# EAGLE schematic AD620_AC (EAGLE 9.6.2)
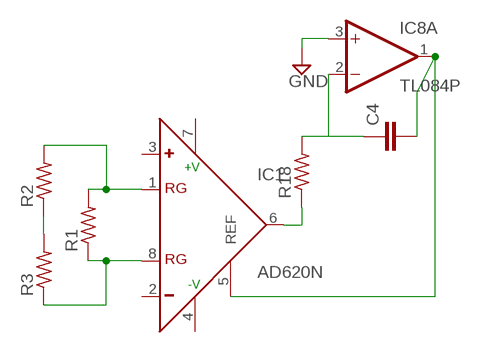
[diagram p0: schematic, sheet 1]

## Parts
C4  C-EU050-030X075  [C050-030X075]
IC1  AD620N  [DIL08]
IC8  TL084P  [DIL14]
R1  R-US_0204/5  [0204/5]
R2  R-US_0204/5  [0204/5]
R3  R-US_0204/5  [0204/5]
R18  R-US_0204/5  [0204/5]

## Nets
GND: IC8.3(A:+IN)
N$1: IC1.1(RG) R1.2 R2.2
N$2: IC1.8(RG) R1.1 R3.1
N$3: R2.1 R3.2
N$5: IC1.6(OUT) R18.1
N$11: C4.1 IC8.2(A:-IN) R18.2
N$20: C4.2 IC1.5(REF) IC8.1(A:OUT)
Unconnected: IC1.2(-) IC1.3(+) IC8.5(B:+IN) IC8.6(B:-IN) IC8.7(B:OUT) IC8.8(C:OUT) IC8.9(C:-IN) IC8.10(C:+IN) IC8.12(D:+IN) IC8.13(D:-IN) IC8.14(D:OUT)

## Power pins joined to a net without a drawn wire
+V: IC1.7(+V)
-V: IC1.4(-V)
V+: IC8.4(P:V+)
V-: IC8.11(P:V-)

## Library data of the parts
C4 = rcl:C-EU: CAPACITOR, European symbol; SPICEPREFIX: C
IC1 = analog-devices:AD620: Low Cost, Low Power, Instrumentation Amplifier Source: http://www.analog.com/UploadedFiles/Data_Sheets/37793330023930AD620_e.pdf; MF: ALTERA CORPORATION; MPN: AD620AN; OC_FARNELL: 1523782; OC_NEWARK: 05F7108
IC8 = linear:TL084: OP AMP
R1-R3 R18 = rcl:R-US_: RESISTOR, American symbol; SPICEPREFIX: R